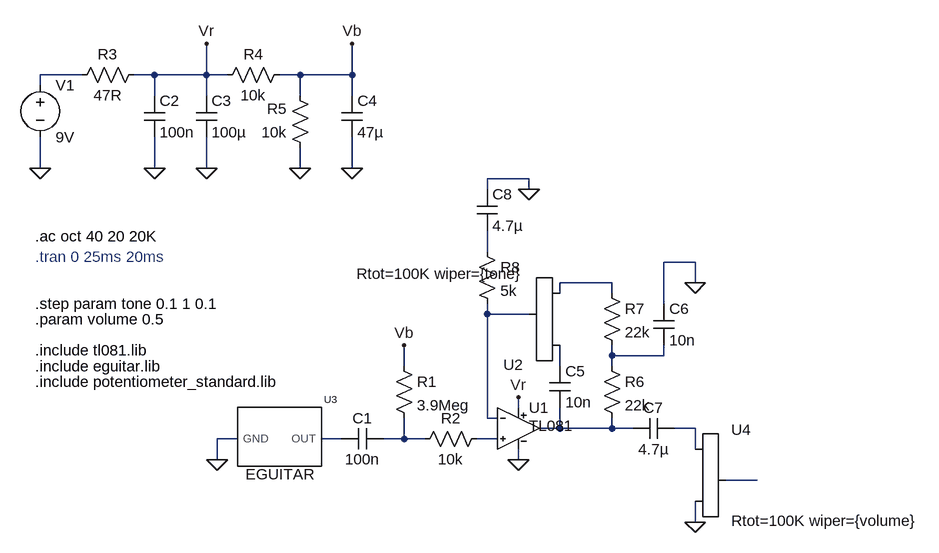
[diagram p0: schematic Booster.asc]
Booster.asc, the LTspice schematic file:
Version 4
SHEET 1 944 680
WIRE -160 -224 -224 -224
WIRE -48 -224 -80 -224
WIRE 32 -224 32 -272
WIRE 32 -224 -48 -224
WIRE 64 -224 32 -224
WIRE 176 -224 144 -224
WIRE 256 -224 256 -272
WIRE 256 -224 176 -224
WIRE -224 -208 -224 -224
WIRE -48 -192 -48 -224
WIRE 32 -192 32 -224
WIRE 176 -192 176 -224
WIRE 256 -192 256 -224
WIRE -224 -80 -224 -128
WIRE -48 -80 -48 -128
WIRE 32 -80 32 -128
WIRE 176 -80 176 -112
WIRE 256 -80 256 -128
WIRE 528 -64 464 -64
WIRE 464 -48 464 -64
WIRE 528 -48 528 -64
WIRE 464 48 464 16
WIRE 784 64 736 64
WIRE 656 96 576 96
WIRE 784 96 784 64
WIRE 576 112 576 96
WIRE 656 112 656 96
WIRE 736 128 736 64
WIRE 464 144 464 128
WIRE 528 144 464 144
WIRE 656 208 656 192
WIRE 736 208 736 192
WIRE 736 208 656 208
WIRE 336 224 336 192
WIRE 576 224 576 192
WIRE 656 224 656 208
WIRE 512 288 512 272
WIRE 464 304 464 144
WIRE 480 304 464 304
WIRE 576 320 576 288
WIRE 576 320 544 320
WIRE 656 320 656 304
WIRE 656 320 576 320
WIRE 688 320 656 320
WIRE 784 320 752 320
WIRE 80 336 48 336
WIRE 240 336 208 336
WIRE 336 336 336 304
WIRE 336 336 304 336
WIRE 368 336 336 336
WIRE 480 336 448 336
WIRE 784 352 784 320
WIRE 48 368 48 336
WIRE 512 368 512 352
WIRE 880 400 832 400
WIRE 784 464 784 432
FLAG 176 -80 0
FLAG 256 -80 0
FLAG 32 -80 0
FLAG -48 -80 0
FLAG 32 -272 Vr
FLAG 256 -272 Vb
FLAG 48 368 0
FLAG 336 192 Vb
FLAG 784 96 0
FLAG 784 464 0
FLAG 512 368 0
FLAG 512 272 Vr
FLAG 528 -48 0
FLAG -224 -80 0
SYMBOL cap 304 320 R90
WINDOW 0 0 32 VBottom 2
WINDOW 3 32 32 VTop 2
SYMATTR InstName C1
SYMATTR Value 100n
SYMBOL res 320 208 R0
SYMATTR InstName R1
SYMATTR Value 3.9Meg
SYMBOL res 464 320 R90
WINDOW 0 0 56 VBottom 2
WINDOW 3 32 56 VTop 2
SYMATTR InstName R2
SYMATTR Value 10k
SYMBOL res -64 -240 R90
WINDOW 0 0 56 VBottom 2
WINDOW 3 32 56 VTop 2
SYMATTR InstName R3
SYMATTR Value 47R
SYMBOL cap -64 -192 R0
SYMATTR InstName C2
SYMATTR Value 100n
SYMBOL cap 16 -192 R0
SYMATTR InstName C3
SYMATTR Value 100µ
SYMBOL res 160 -240 R90
WINDOW 0 0 56 VBottom 2
WINDOW 3 32 56 VTop 2
SYMATTR InstName R4
SYMATTR Value 10k
SYMBOL res 192 -96 R180
WINDOW 0 36 76 Left 2
WINDOW 3 36 40 Left 2
SYMATTR InstName R5
SYMATTR Value 10k
SYMBOL cap 240 -192 R0
SYMATTR InstName C4
SYMATTR Value 47µ
SYMBOL potentiometer_standard 592 208 R180
SYMATTR InstName U2
SYMATTR Value Rtot=100K wiper={tone}
SYMATTR SpiceLine ""
SYMBOL cap 560 224 R0
SYMATTR InstName C5
SYMATTR Value 10n
SYMBOL eguitar 176 352 R0
SYMATTR InstName U3
SYMBOL res 640 208 R0
SYMATTR InstName R6
SYMATTR Value 22k
SYMBOL res 640 96 R0
SYMATTR InstName R7
SYMATTR Value 22k
SYMBOL cap 720 128 R0
SYMATTR InstName C6
SYMATTR Value 10n
SYMBOL cap 752 304 R90
WINDOW 0 0 32 VBottom 2
WINDOW 3 32 32 VTop 2
SYMATTR InstName C7
SYMATTR Value 4.7µ
SYMBOL potentiometer_standard 768 336 R0
SYMATTR InstName U4
SYMATTR Value Rtot=100K wiper={volume}
SYMATTR SpiceLine ""
SYMBOL TL081 512 256 R0
WINDOW 3 16 60 Left 2
SYMATTR Value TL081
SYMATTR InstName U1
SYMBOL res 448 32 R0
SYMATTR InstName R8
SYMATTR Value 5k
SYMBOL cap 448 -48 R0
SYMATTR InstName C8
SYMATTR Value 4.7µ
SYMBOL voltage -224 -224 R0
WINDOW 123 0 0 Left 0
WINDOW 39 0 0 Left 0
SYMATTR InstName V1
SYMATTR Value 9V
TEXT -232 24 Left 2 !.ac oct 40 20 20K
TEXT -232 56 Left 2 ;.tran 0 25ms 20ms
TEXT -232 128 Left 2 !.step param tone 0.1 1 0.1
TEXT -232 152 Left 2 !.param volume 0.5
TEXT -232 224 Left 2 !.include eguitar.lib
TEXT -232 248 Left 2 !.include potentiometer_standard.lib
TEXT -232 200 Left 2 !.include tl081.lib

The netlist it stands for:
* Booster.asc
C1 N010 N009 100n
R1 Vb N010 3.9Meg
R2 N011 N010 10k
R3 Vr N001 47R
C2 Vr 0 100n
C3 Vr 0 100µ
R4 Vb Vr 10k
R5 0 Vb 10k
C4 Vb 0 47µ
XU2 N006 N003 N004 Rtot=100K wiper={tone}
C5 N006 N007 10n
XU3 N009 0 EGUITAR  ; pins OUT GND
R6 N005 N007 22k
R7 N003 N005 22k
C6 0 N005 10n
C7 N008 N007 4.7µ
XU4 N008 0 N012 Rtot=100K wiper={volume}
XU1 N011 N004 Vr 0 N007 TL081 TL081  ; pins In+ In- V+ V- OUT
R8 N002 N004 5k
C8 0 N002 4.7µ
V1 N001 0 9V
.ac oct 40 20 20K
* .tran 0 25ms 20ms
.step param tone 0.1 1 0.1
.param volume 0.5
.include eguitar.lib
.include potentiometer_standard.lib
.include tl081.lib
.lib eguitar.lib
.lib TL081.lib
.backanno
.end